# Altium schematic sheet Emulator.SchDoc: Shepherd - Emulator
size 379 x 240 mm; Author: Ingmar; CompanyName: NES Lab / TU Dresden; DocumentNumber: 5; SheetNumber: 5; SheetTotal: 8
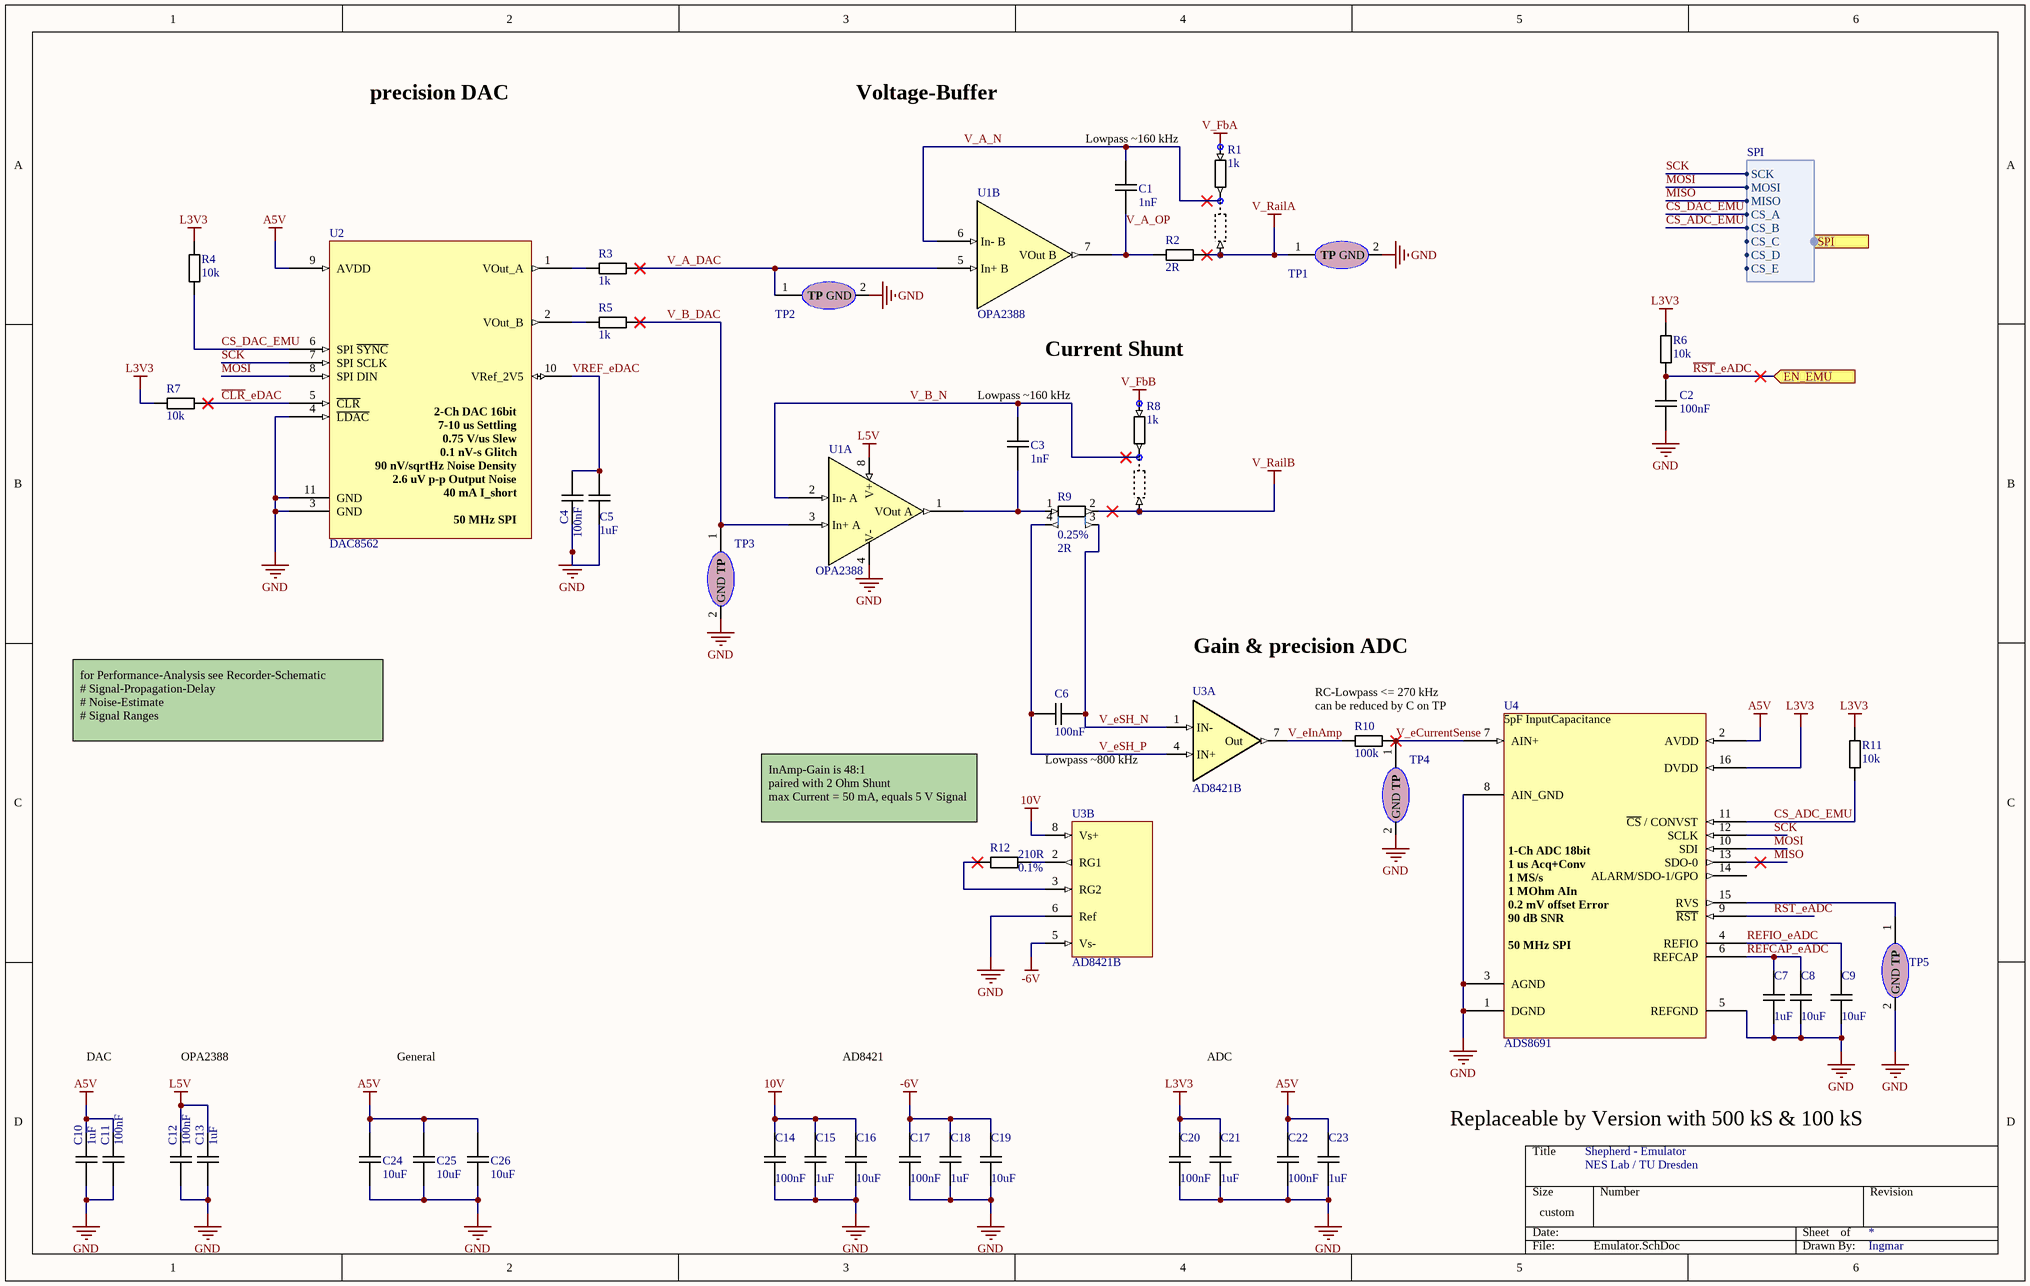
[diagram p0: Emulator.SchDoc]

## Parts
C1  value 1nF  [CAPC1005X06]  (hidden comment: C_0402_1nF_50V)
C2  value 100nF  [CAPC1005X06]  (hidden comment: C_0402_100nF_16V)
C3  value 1nF  [CAPC1005X06]  (hidden comment: C_0402_1nF_50V)
C4  value 100nF  [CAPC1005X06]  (hidden comment: C_0402_100nF_16V)
C5  value 1uF  [CAPC1005X06]  (hidden comment: C_0402_1uF_25V)
C6  value 100nF  [CAPC1005X06]  (hidden comment: C_0402_100nF_16V)
C7  value 1uF  [CAPC1005X06]  (hidden comment: C_0402_1uF_25V)
C8  value 10uF  [CAPC1608X09]  (hidden comment: C_0603_10uF_16V)
C9  value 10uF  [CAPC1608X09]  (hidden comment: C_0603_10uF_16V)
C10  value 1uF  [CAPC1005X06]  (hidden comment: C_0402_1uF_25V)
C11  value 100nF  [CAPC1005X06]  (hidden comment: C_0402_100nF_16V)
C12  value 100nF  [CAPC1005X06]  (hidden comment: C_0402_100nF_16V)
C13  value 1uF  [CAPC1005X06]  (hidden comment: C_0402_1uF_25V)
C14  value 100nF  [CAPC1005X06]  (hidden comment: C_0402_100nF_16V)
C15  value 1uF  [CAPC1005X06]  (hidden comment: C_0402_1uF_25V)
C16  value 10uF  [CAPC1608X09]  (hidden comment: C_0603_10uF_16V)
C17  value 100nF  [CAPC1005X06]  (hidden comment: C_0402_100nF_16V)
C18  value 1uF  [CAPC1005X06]  (hidden comment: C_0402_1uF_25V)
C19  value 10uF  [CAPC1608X09]  (hidden comment: C_0603_10uF_16V)
C20  value 100nF  [CAPC1005X06]  (hidden comment: C_0402_100nF_16V)
C21  value 1uF  [CAPC1005X06]  (hidden comment: C_0402_1uF_25V)
C22  value 100nF  [CAPC1005X06]  (hidden comment: C_0402_100nF_16V)
C23  value 1uF  [CAPC1005X06]  (hidden comment: C_0402_1uF_25V)
C24  value 10uF  [CAPC1608X09]  (hidden comment: C_0603_10uF_16V)
C25  value 10uF  [CAPC1608X09]  (hidden comment: C_0603_10uF_16V)
C26  value 10uF  [CAPC1608X09]  (hidden comment: C_0603_10uF_16V)
R1  value 1k  [RESC1005X04-SEL]  (hidden comment: R_0402_1k)
R2  value 2R  [RESC1005X04]  (hidden comment: R_0402_2R)
R3  value 1k  [RESC1005X04]  (hidden comment: R_0402_1k)
R4  value 10k  [RESC1005X04]  (hidden comment: R_0402_10k)
R5  value 1k  [RESC1005X04]  (hidden comment: R_0402_1k)
R6  value 10k  [RESC1005X04]  (hidden comment: R_0402_10k)
R7  value 10k  [RESC1005X04]  (hidden comment: R_0402_10k)
R8  value 1k  [RESC1005X04-SEL]  (hidden comment: R_0402_1k)
R9  value 2R  Tolerance: 0.25%  [RESC3116X06 Shunt]  (hidden comment: R_1206_2R_0.25%)
R10  value 100k  [RESC1005X04]  (hidden comment: R_0402_100k_1%)
R11  value 10k  [RESC1005X04]  (hidden comment: R_0402_10k)
R12  value 210R  Tolerance: 0.1%  [RESC1005X04]  (hidden comment: R_0402_210R_0.1%)
TP1  Testpoint  [P_Testpins_Precision]  (value not drawn)  (no BOM)
TP2  Testpoint  [P_Testpins_Precision]  (value not drawn)  (no BOM)
TP3  Testpoint  [P_Testpins_Precision]  (value not drawn)  (no BOM)
TP4  Testpoint  [P_Testpins_Precision]  (value not drawn)  (no BOM)
TP5  Testpoint  [P_Testpins_Precision]  (value not drawn)  (no BOM)
U1  OPA2388  [TSOP65P490X110-8N]  (parts A,B of 2)
U2  DAC8562  [PSON50P300X80_HS-11N]
U3  AD8421B  [TSOP65P490X110-8N]  (parts A,B of 2)
U4  ADS8691  [TSOP65P640X120-16N]

## Ports
EN_EMU (in), SPI (in, harness SPI)

## Harnesses
SPI: SCK, MOSI, MISO, CS_A, CS_B, CS_C, CS_D, CS_E

## Nets
10V: C14.2 C15.2 C16.2 U3.8(Vs+)
-6V: C17.2 C18.2 C19.2 U3.5(Vs-)
A5V: C10.2 C11.2 C22.2 C23.2 C24.2 C25.2 C26.2 U2.9(AVDD) U4.2(AVDD)
GND: C2.1 C4.2 C5.1 C7.1 C8.1 C9.1 C10.1 C11.1 C12.1 C13.1 C14.1 C15.1 C16.1 C17.1 C18.1 C19.1 C20.1 C21.1 C22.1 C23.1 C24.1 C25.1 C26.1 TP1.2(GND) TP2.2(GND) TP3.2(GND) TP4.2(GND) TP5.2(GND) U1.4(V-) U2.3(GND) U2.4(~{LDAC}) U2.11(GND) U3.6(Ref) U4.1(DGND) U4.3(AGND) U4.5(REFGND) U4.8(AIN_GND)
L3V3: C20.2 C21.2 R4.2 R6.1 R7.2 R11.1 U4.16(DVDD)
L5V: C12.2 C13.2 U1.8(V+)
V_FbA: R1.1
V_FbB: R8.1
V_RailA: R1.3 R2.2 TP1.1(TP)
V_RailB: R8.3 R9.2
~{CLR}_eDAC: R7.1 U2.5(~{CLR})
CS_ADC_EMU: R11.2 U4.11(~{CS}_/_CONVST) ; port SPI.CS_B
CS_DAC_EMU: R4.1 U2.6(SPI_~{SYNC}) ; port SPI.CS_A
MISO: U4.13(SDO-0) ; port SPI.MISO
MOSI: U2.8(SPI_DIN) U4.10(SDI) ; port SPI.MOSI
~{RST}_eADC: C2.2 R6.2 U4.9(~{RST}) ; port EN_EMU
REFCAP_eADC: C7.2 C8.2 U4.6(REFCAP)
REFIO_eADC: C9.2 U4.4(REFIO)
SCK: U2.7(SPI_SCLK) U4.12(SCLK) ; port SPI.SCK
V_A_DAC: R3.2 TP2.1(TP) U1.5(In+_B)
V_A_N: C1.2 R1.2 U1.6(In-_B)
V_A_OP: C1.1 R2.1 U1.7(VOut_B)
V_B_DAC: R5.2 TP3.1(TP) U1.3(In+_A)
V_B_N: C3.2 R8.2 U1.2(In-_A)
V_eCurrentSense: R10.2 TP4.1(TP) U4.7(AIN+)
V_eInAmp: R10.1 U3.7(Out)
V_eSH_N: C6.2 R9.3 U3.1(IN-)
V_eSH_P: C6.1 R9.4 U3.4(IN+)
VREF_eDAC: C4.1 C5.2 U2.10(VRef_2V5)
NetC3_1: C3.1 R9.1 U1.1(VOut_A)
NetR3_1: R3.1 U2.1(VOut_A)
NetR5_1: R5.1 U2.2(VOut_B)
NetR12_1: R12.1 U3.3(RG2)
NetR12_2: R12.2 U3.2(RG1)
NetTP5_1: TP5.1(TP) U4.15(RVS)

Not connected (* = marked no-connect by the designer): U4 14(ALARM/SDO-1/GPO)

## Notes on the sheet
- precision DAC
- Voltage-Buffer
- Lowpass ~160 kHz
- Current Shunt
- (near C3) Lowpass ~160 kHz
- Gain & precision ADC
- RC-Lowpass <= 270 kHz
- for Performance-Analysis see Recorder-Schematic
  # Signal-Propagation-Delay
  # Noise-Estimate
  # Signal Ranges
- Lowpass ~800 kHz
- (near R10) can be reduced by C on TP
- (near U4) 5pF InputCapacitance
- (near R12) InAmp-Gain is 48:1
  paired with 2 Ohm Shunt
  max Current = 50 mA, equals 5 V Signal
- DAC
- OPA2388
- General
- AD8421
- ADC
- Replaceable by Version with 500 kS & 100 kS
- (in symbol ADS8691) 1-Ch ADC 18bit / 1 us Acq+Conv / 1 MS/s / 1 MOhm AIn / 0.2 mV offset Error / 90 dB SNR / 50 MHz SPI /
- (in symbol DAC8562-DSC) 2-Ch DAC 16bit / 7-10 us Settling / 0.75 V/us Slew / 0.1 nV-s Glitch / 90 nV/sqrtHz Noise Density / 2.6 uV p-p Output Noise / 40 mA I_short / 50 MHz SPI

## Library data of the parts
C1 C3 = .C_0402_1nF_50V: Capacitor; Manufacturer: Murata; Manufacturer PN: GRM1555C1H102JA01D; V_max: 50V; Tolerance: 5%; Dielectric: C0G; Distributer: Mouser; Distributer PN: 81-GRM1555C1H102JA1D; Price n10 [€]: 0.02
C2 C4 C6 C11 C12 C14 C17 C20 C22 = .C_0402_100nF_16V: Capacitor; Manufacturer: Taiyo Yuden; Manufacturer PN: EMF105B7104MVHF; V_max: 16V; Tolerance: 20%; Dielectric: X7R; Distributer: Mouser; Distributer PN: 963-EMF105B7104MVHF; Price n10 [€]: 0.03
C5 C7 C10 C13 C15 C18 C21 C23 = .C_0402_1uF_25V: Capacitor; Manufacturer: Murata; Manufacturer PN: GRM155R61E105KA12J; V_max: 25V; Tolerance: 10%; Dielectric: X5R; Distributer: Mouser; Distributer PN: 81-GRM155R61E105KA2J; Price n10 [€]: 0.06
C8 C9 C16 C19 C24-C26 = .C_0603_10uF_16V: Capacitor; Manufacturer: Taiyo Yuden; Manufacturer PN: EMK107BBJ106MA-T; V_max: 16V; Tolerance: 20%; Dielectric: X5R; Distributer: Mouser; Distributer PN: 963-EMK107BBJ106MA-T; Price n10 [€]: 0.14
R1 R8 = .R_0402_1k_SEL: Resistor; Manufacturer: Panasonic; Manufacturer PN: ERJ-2GEJ102X; P_max: 100mW; V_max: 50V; Tolerance: 5%; Distributer: Mouser; Distributer PN: 667-ERJ-2GEJ102X; Price n10 [€]: 0.02
R2 = .R_0402_2R: Resistor; Manufacturer: Panasonic; Manufacturer PN: ERJ-2GEJ2R0X; P_max: 100mW; V_max: 50V; Tolerance: 5%; Distributer: Mouser; Distributer PN: 667-ERJ-2GEJ2R0X; Price n10 [€]: 0.02
R3 R5 = .R_0402_1k: Resistor; Manufacturer: Panasonic; Manufacturer PN: ERJ-2GEJ102X; P_max: 100mW; V_max: 50V; Tolerance: 5%; Distributer: Mouser; Distributer PN: 667-ERJ-2GEJ102X; Price n10 [€]: 0.02
R4 R6 R7 R11 = .R_0402_10k: Resistor; Manufacturer: Panasonic; Manufacturer PN: ERJ-2GEJ103X; P_max: 100mW; V_max: 50V; Tolerance: 5%; Distributer: Mouser; Distributer PN: 667-ERJ-2GEJ103X; Price n10 [€]: 0.02
R9 = .R_1206_2R_0.25%: Resistor 25 ppm/C; Manufacturer: Yageo; Manufacturer PN: RT1206CRD072RL; P_max: 250mW; V_max: 200V; Distributer: Mouser; Distributer PN: 603-RT1206CRD072RL; Price n10 [€]: 0.35
R10 = .R_0402_100k: Resistor; Manufacturer: Panasonic; Manufacturer PN: ERJ-2RKF1003X; P_max: 100mW; V_max: 50V; Tolerance: 1%; Distributer: Mouser; Distributer PN: 667-ERJ-2RKF1003X; Price n10 [€]: 0.02
R12 = .R_0402_210R_0.1%: Resistor 25ppm/C; Manufacturer: Yageo; Manufacturer PN: RT0402BRD07210RL; P_max: 62mW; V_max: 50V; Distributer: Mouser; Distributer PN: 603-RT0402BRD07210RL; Price n10 [€]: 0.19
TP1-TP5 = Testpoint_Precision
U1 = OPA2388: OpAmp High Precision, 30-60 mA perm, 5 V/us Slew, 7 nV/sqrtHz NoiseDist, 0.25 uV Offset, Z_id 100 MOhm, Z_ic 60 TOhm; Manufacturer: TI; Manufacturer PN: OPA2388IDGKR; V_max: 5.5V; V_min: 2.5V; Distributer: Mouser; Distributer PN: 595-OPA2388IDGKR; Price n10 [€]: 2.63
U2 = DAC8562-DSC: DAC, 2 CH, 10 us Settling, 16 bit Res, 50 MHz SPI; Manufacturer: TI; Manufacturer PN: DAC8562SDSCR; V_max: 5.5V; V_min: 2.7V; Distributer: Mouser; Distributer PN: 595-DAC8562SDSCR; Price n10 [€]: 6.73
U3 = AD8421B: Low Noise InAmp, / 134 dB CMRR @ G100, f60Hz / 0.1 % Gain Error / 10 ppm Gain NonLin / 65mA max Output; Manufacturer: Analog; Manufacturer PN: AD8421BRMZ; I_max: 2.3mA; V_max: 18V; V_min: 2.5V; Distributer: Mouser; Distributer PN: 584-AD8421BRMZ; Price n10 [€]: 8.10
U4 = ADS8691: ADC, 1CH, 18 Bit, 1 MS/s, 50 MHz SPI, 335 ns Acq & 665 ns Conv; Manufacturer: TI; Manufacturer PN: ADS8691IPWR; V_max: 5.25V; V_min: 1.65V; Distributer: Mouser; Distributer PN: 595-ADS8691IPWR; Price n10 [€]: 8.5